# Altium project SDRplay.PrjPCB
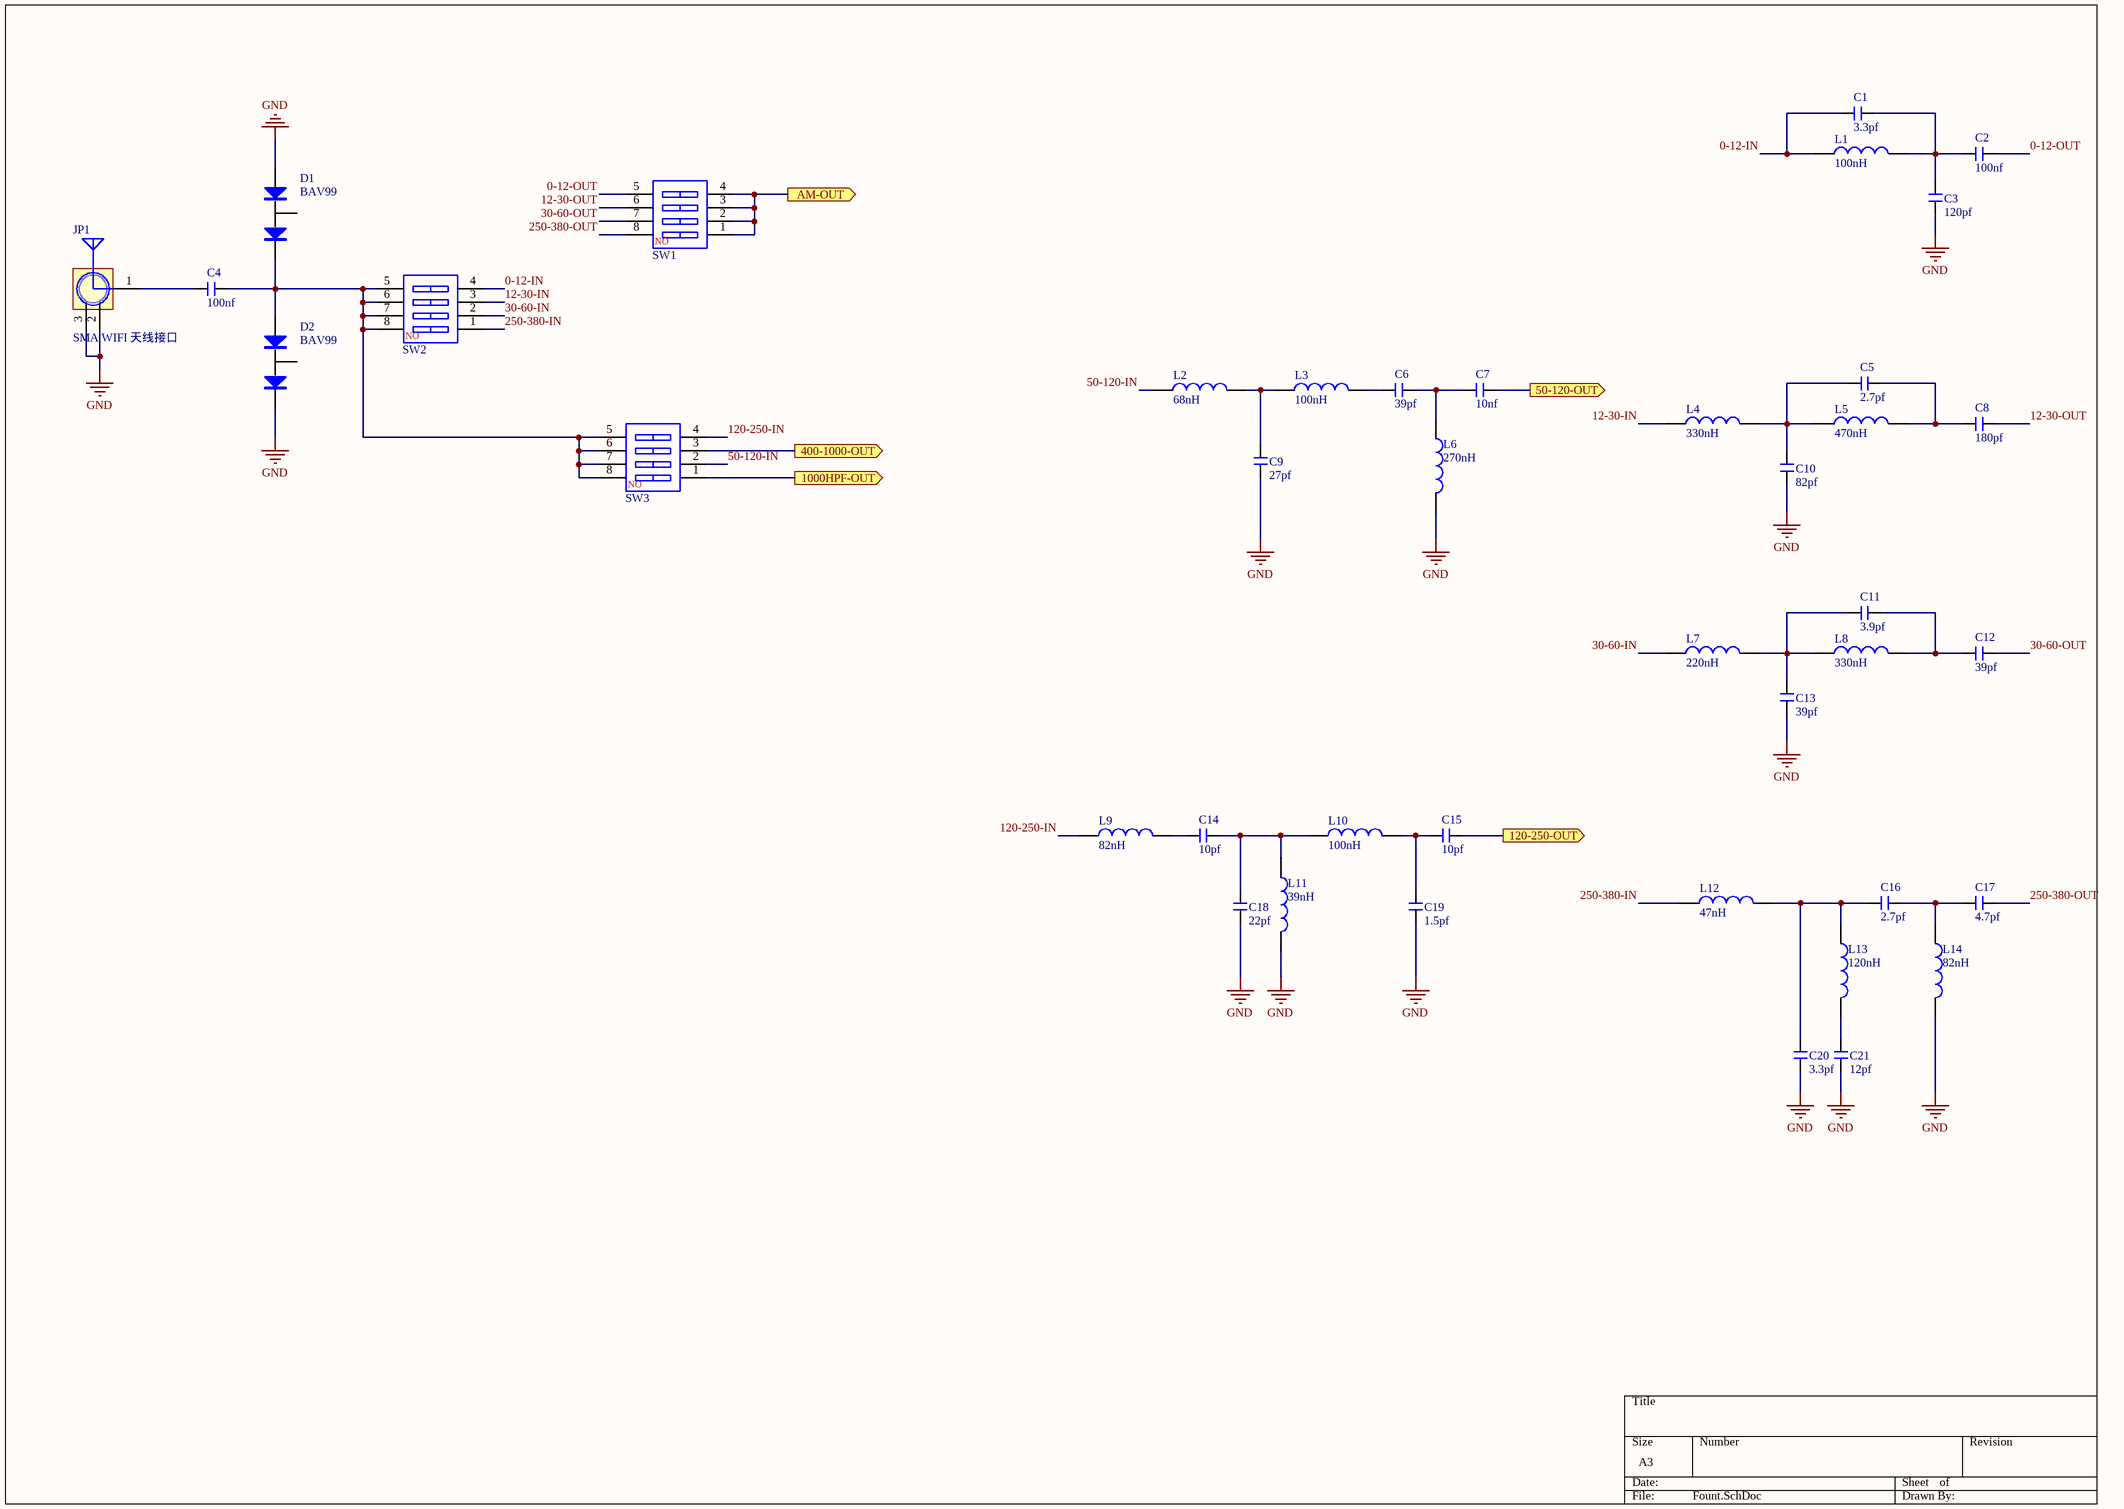
[diagram p0: Fount.SchDoc]
3 sheets, 89 parts. Net scope: flat (ports and power ports of the same name join across sheets).
Board file: SDRplay.PcbDoc
Sheets:
  Fount.SchDoc
  Msi001.SchDoc
  Msi2500.SchDoc

## Sheet Fount.SchDoc
size A3

### Parts
C1  3.3pf  [C 0603_M]
C2  100nf  [C 0603_M]
C3  120pf  [C 0603_M]
C4  100nf  [C 0603_M]
C5  2.7pf  [C 0603_M]
C6  39pf  [C 0603_M]
C7  10nf  [C 0603_M]
C8  180pf  [C 0603_M]
C9  27pf  [C 0603_M]
C10  82pf  [C 0603_M]
C11  3.9pf  [C 0603_M]
C12  39pf  [C 0603_M]
C13  39pf  [C 0603_M]
C14  10pf  [C 0603_M]
C15  10pf  [C 0603_M]
C16  2.7pf  [C 0603_M]
C17  4.7pf  [C 0603_M]
C18  22pf  [C 0603_M]
C19  1.5pf  [C 0603_M]
C20  3.3pf  [C 0603_M]
C21  12pf  [C 0603_M]
D1  BAV99  [SOT23-3M]
D2  BAV99  [SOT23-3M]
JP1  SMA WIFI 天线接口  [SMA-KE]
L1  100nH  [L 0603]
L2  68nH  [L 0603]
L3  100nH  [L 0603]
L4  330nH  [L 0603]
L5  470nH  [L 0603]
L6  270nH  [L 0603]
L7  220nH  [L 0603]
L8  330nH  [L 0603]
L9  82nH  [L 0603]
L10  100nH  [L 0603]
L11  39nH  [L 0603]
L12  47nH  [L 0603]
L13  120nH  [L 0603]
L14  82nH  [L 0603]
SW1  CSW-4P  [CSW1.27 SMD-4P]  (value not drawn)
SW2  CSW-4P  [CSW1.27 SMD-4P]  (value not drawn)
SW3  CSW-4P  [CSW1.27 SMD-4P]  (value not drawn)

### Ports
50-120-OUT (out), 120-250-OUT (out), 400-1000-OUT (out), 1000HPF-OUT (out), AM-OUT (out)

### Nets
GND: C3.1 C9.1 C10.2 C13.2 C18.1 C19.1 C20.1 C21.1 D1.1 D2.2 JP1.2(GND) JP1.3(GND) L6.2 L11.2 L14.2
0-12-IN: C1.1 L1.1 SW2.4
0-12-OUT: C2.2 SW1.5
12-30-IN: L4.1 SW2.3
12-30-OUT: C8.2 SW1.6
30-60-IN: L7.1 SW2.2
30-60-OUT: C12.2 SW1.7
50-120-IN: L2.1 SW3.2
120-250-IN: L9.1 SW3.4
250-380-IN: L12.1 SW2.1
250-380-OUT: C17.2 SW1.8
NetC1_2: C1.2 C2.1 C3.2 L1.2
NetC4_1: C4.1 JP1.1(ANT)
NetC4_2: C4.2 D1.2 D2.1 SW2.5 SW2.6 SW2.7 SW2.8 SW3.5 SW3.6 SW3.7 SW3.8
NetC5_1: C5.1 C10.1 L4.2 L5.1
NetC5_2: C5.2 C8.1 L5.2
NetC6_1: C6.1 L3.2
NetC6_2: C6.2 C7.1 L6.1
NetC7_2: C7.2 ; port 50-120-OUT
NetC9_2: C9.2 L2.2 L3.1
NetC11_1: C11.1 C13.1 L7.2 L8.1
NetC11_2: C11.2 C12.1 L8.2
NetC14_1: C14.1 L9.2
NetC14_2: C14.2 C18.2 L10.1 L11.1
NetC15_1: C15.1 C19.2 L10.2
NetC15_2: C15.2 ; port 120-250-OUT
NetC16_1: C16.1 C20.2 L12.2 L13.1
NetC16_2: C16.2 C17.1 L14.1
NetC21_2: C21.2 L13.2
NetC26_2: SW1.1 SW1.2 SW1.3 SW1.4 ; port AM-OUT
NetSW3_1: SW3.1 ; port 1000HPF-OUT
NetSW3_3: SW3.3 ; port 400-1000-OUT

Not connected (* = marked no-connect by the designer): D1 3; D2 3

### Notes on the sheet
- (in symbol CSW-4P) NO

### Library data of the parts
C1-C21 = C: 无极性贴片电容; 版权归属: 源创客; BOM名称: 无极性贴片电容; 学习资源: www.ooocke.com
D1 D2 = BAV99: 天线保护二极管
JP1 = SMA: SMA-2.4G射频天线接口; 版权归属: 源创客; BOM名称: SMA-2.4G射频天线接口; 学习资源: www.ooocke.com
L1-L14 = L: 小功率贴片电感; 版权归属: 源创客; BOM名称: 小功率贴片电感; 学习资源: www.ooocke.com
SW1-SW3 = CSW-4P: 4路编码开关; 版权归属: 源创客; BOM名称: 4路编码开关; 学习资源: www.ooocke.com

## Sheet Msi001.SchDoc
size A3
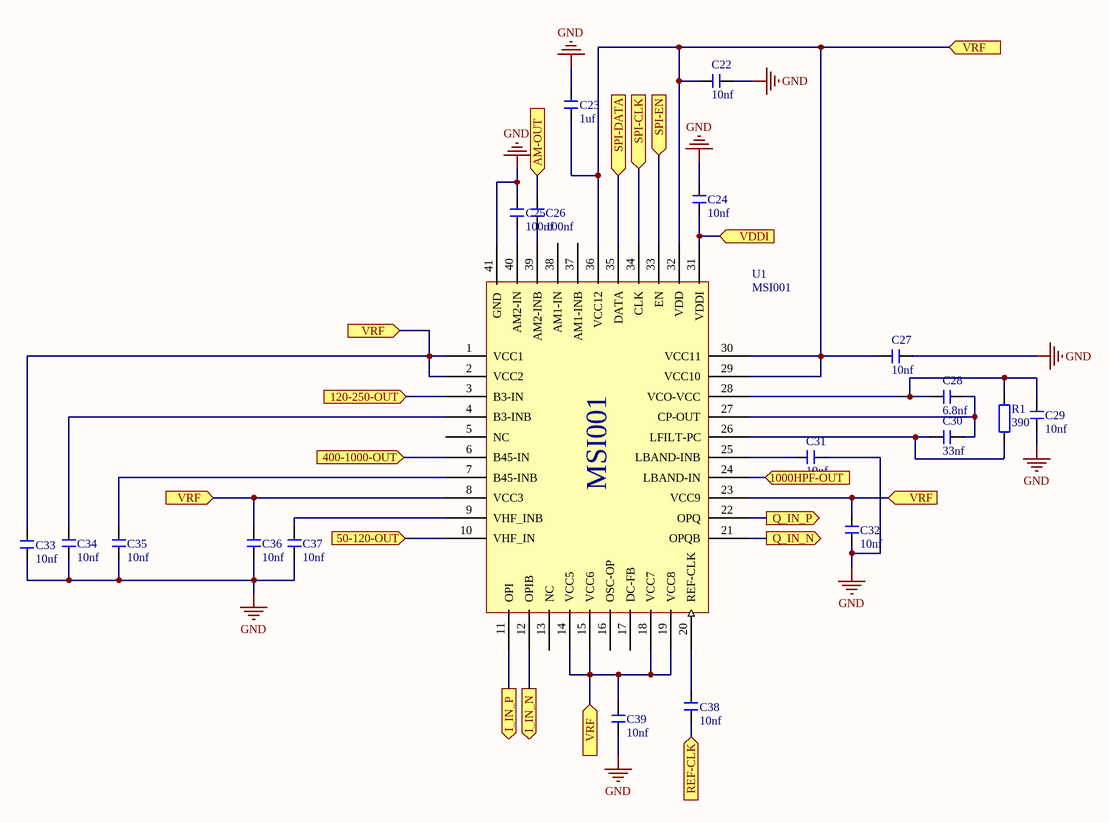
[diagram p1: Msi001.SchDoc]

### Parts
C22  10nf  [C 0603_M]
C23  1uf  [C 0603_M]
C24  10nf  [C 0603_M]
C25  100nf  [C 0603_M]
C26  100nf  [C 0603_M]
C27  10nf  [C 0603_M]
C28  6.8nf  [C 0603_M]
C29  10nf  [C 0603_M]
C30  33nf  [C 0603_M]
C31  10nf  [C 0603_M]
C32  10nf  [C 0603_M]
C33  10nf  [C 0603_M]
C34  10nf  [C 0603_M]
C35  10nf  [C 0603_M]
C36  10nf  [C 0603_M]
C37  10nf  [C 0603_M]
C38  10nf  [C 0603_M]
C39  10nf  [C 0603_M]
R1  390  [R 0603_M]
U1  MSI001  [QFN40 6X6_M]

### Ports
50-120-OUT (in), 120-250-OUT (in), 400-1000-OUT (in), 1000HPF-OUT (in), AM-OUT (in), I_IN_N (out), I_IN_P (out), Q_IN_N (out), Q_IN_P (out), REF-CLK (in), SPI-CLK (in), SPI-DATA (in), SPI-EN (in), VDDI (in), VRF (in)

### Nets
GND: C22.1 C23.2 C24.2 C25.2 C27.1 C29.2 C31.2 C32.2 C33.1 C34.1 C35.2 C36.1 C37.1 C39.2 U1.41(GND)
NetC7_2: U1.10(VHF_IN) ; port 50-120-OUT
NetC15_2: U1.3(B3-IN) ; port 120-250-OUT
NetC22_2: C22.2 C23.1 C27.2 C32.1 C33.2 C36.2 C39.1 U1.1(VCC1) U1.2(VCC2) U1.8(VCC3) U1.14(VCC5) U1.15(VCC6) U1.18(VCC7) U1.19(VCC8) U1.23(VCC9) U1.29(VCC10) U1.30(VCC11) U1.32(VDD) U1.36(VCC12) ; port VRF
NetC24_1: C24.1 U1.31(VDDI) ; port VDDI
NetC25_1: C25.1 U1.40(AM2-IN)
NetC26_1: C26.1 U1.39(AM2-INB)
NetC26_2: C26.2 ; port AM-OUT
NetC28_1: C28.1 C30.1 U1.27(CP-OUT)
NetC28_2: C28.2 C29.1 R1.1 U1.28(VCO-VCC)
NetC30_2: C30.2 R1.2 U1.26(LFILT-PC)
NetC31_1: C31.1 U1.25(LBAND-INB)
NetC34_2: C34.2 U1.4(B3-INB)
NetC35_1: C35.1 U1.7(B45-INB)
NetC37_2: C37.2 U1.9(VHF_INB)
NetC38_1: C38.1 U1.20(REF-CLK)
NetC38_2: C38.2 ; port REF-CLK
NetSW3_1: U1.24(LBAND-IN) ; port 1000HPF-OUT
NetSW3_3: U1.6(B45-IN) ; port 400-1000-OUT
NetU1_11: U1.11(OPI) ; port I_IN_P
NetU1_12: U1.12(OPIB) ; port I_IN_N
NetU1_21: U1.21(OPQB) ; port Q_IN_N
NetU1_22: U1.22(OPQ) ; port Q_IN_P
NetU1_33: U1.33(EN) ; port SPI-EN
NetU1_34: U1.34(CLK) ; port SPI-CLK
NetU1_35: U1.35(DATA) ; port SPI-DATA

Not connected (* = marked no-connect by the designer): U1 5(NC) 13(NC) 16(OSC-OP) 17(DC-FB) 37(AM1-INB) 38(AM1-IN)

### Library data of the parts
C22-C39 = C: 无极性贴片电容; 版权归属: 源创客; BOM名称: 无极性贴片电容; 学习资源: www.ooocke.com
R1 = R: 贴片电阻; 版权归属: 源创客; BOM名称: 贴片电阻; 学习资源: www.ooocke.com
U1 = MSI001: tuner

## Sheet Msi2500.SchDoc
size A3
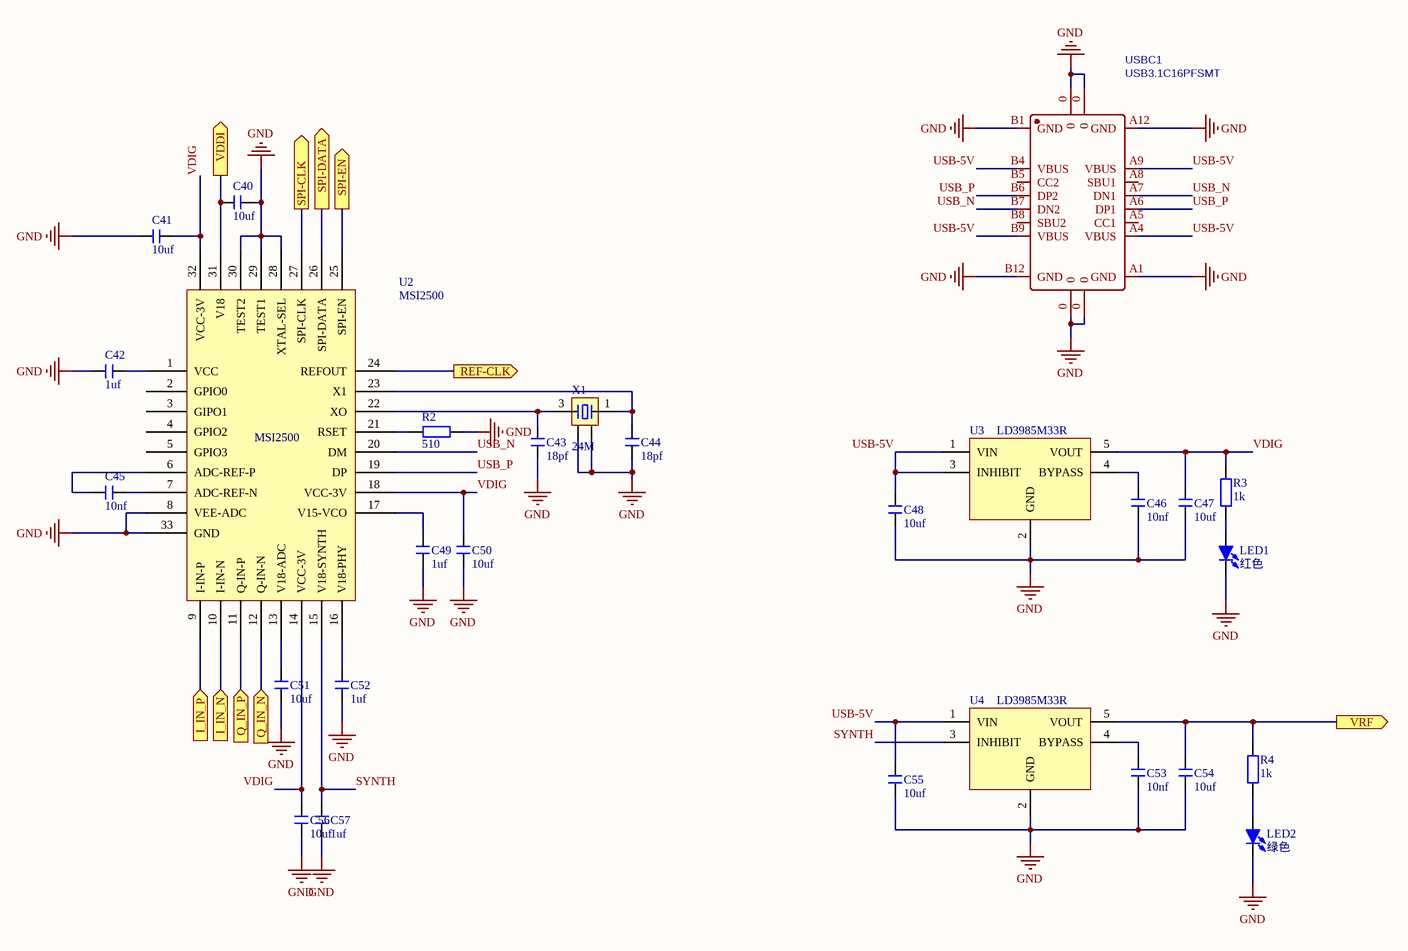
[diagram p2: Msi2500.SchDoc]

### Parts
C40  10uf  [C 0603_M]
C41  10uf  [C 0603_M]
C42  1uf  [C 0603_M]
C43  18pf  [C 0603_M]
C44  18pf  [C 0603_M]
C45  10nf  [C 0603_M]
C46  10nf  [C 0603_M]
C47  10uf  [C 0603_M]
C48  10uf  [C 0603_M]
C49  1uf  [C 0603_M]
C50  10uf  [C 0603_M]
C51  10uf  [C 0603_M]
C52  1uf  [C 0603_M]
C53  10nf  [C 0603_M]
C54  10uf  [C 0603_M]
C55  10uf  [C 0603_M]
C56  10uf  [C 0603_M]
C57  1uf  [C 0603_M]
LED1  红色  [LED 0805G]
LED2  绿色  [LED 0805G]
R2  510  [R 0603_M]
R3  1k  [R 0603_M]
R4  1k  [R 0603_M]
U2  MSI2500  [QFN32 5x5_M]
U3  LD3985M33R  [SOT23-5]
U4  LD3985M33R  [SOT23-5]
USBC1  USB3.1C16PFSMT  [USB-TYPEC-16PIN]
X1  24M  [OSC 3225-4P]

### Ports
I_IN_N (in), I_IN_P (in), Q_IN_N (in), Q_IN_P (in), REF-CLK (out), SPI-CLK (out), SPI-DATA (out), SPI-EN (out), VDDI (out), VRF (out)

### Nets
GND: C40.1 C41.2 C42.1 C43.2 C44.2 C46.1 C47.1 C48.1 C49.2 C50.2 C51.2 C52.2 C53.1 C54.1 C55.1 C56.2 C57.2 LED1.2(K) LED2.2(K) R2.1 U2.8(VEE-ADC) U2.28(XTAL-SEL) U2.29(TEST1) U2.30(TEST2) U2.33(GND) U3.2(GND) U4.2(GND) USBC1.0 USBC1.A1(GND) USBC1.A12(GND) USBC1.B1(GND) USBC1.B12(GND) X1.2 X1.4
SYNTH: C57.1 U2.15(V18-SYNTH) U4.3(INHIBIT)
USB-5V: C48.2 C55.2 U3.1(VIN) U3.3(INHIBIT) U4.1(VIN) USBC1.A4(VBUS) USBC1.A9(VBUS) USBC1.B4(VBUS) USBC1.B9(VBUS)
USB_N: U2.20(DM) USBC1.A7(DN1) USBC1.B7(DN2)
USB_P: U2.19(DP) USBC1.A6(DP1) USBC1.B6(DP2)
VDIG: C41.1 C47.2 C50.1 C56.1 R3.1 U2.14(VCC-3V) U2.18(VCC-3V) U2.32(VCC-3V) U3.5(VOUT)
NetC22_2: C54.2 R4.1 U4.5(VOUT) ; port VRF
NetC24_1: C40.2 U2.31(V18) ; port VDDI
NetC38_2: U2.24(REFOUT) ; port REF-CLK
NetC42_2: C42.2 U2.1(VCC)
NetC43_1: C43.1 U2.22(XO) X1.3
NetC44_1: C44.1 U2.23(X1) X1.1
NetC45_1: C45.1 U2.6(ADC-REF-P)
NetC45_2: C45.2 U2.7(ADC-REF-N)
NetC46_2: C46.2 U3.4(BYPASS)
NetC49_1: C49.1 U2.17(V15-VCO)
NetC51_1: C51.1 U2.13(V18-ADC)
NetC52_1: C52.1 U2.16(V18-PHY)
NetC53_2: C53.2 U4.4(BYPASS)
NetLED1_1: LED1.1(A) R3.2
NetLED2_1: LED2.1(A) R4.2
NetR2_2: R2.2 U2.21(RSET)
NetU1_11: U2.9(I-IN-P) ; port I_IN_P
NetU1_12: U2.10(I-IN-N) ; port I_IN_N
NetU1_21: U2.12(Q-IN-N) ; port Q_IN_N
NetU1_22: U2.11(Q-IN-P) ; port Q_IN_P
NetU1_33: U2.25(SPI-EN) ; port SPI-EN
NetU1_34: U2.27(SPI-CLK) ; port SPI-CLK
NetU1_35: U2.26(SPI-DATA) ; port SPI-DATA

Not connected (* = marked no-connect by the designer): U2 2(GPIO0) 3(GIPO1) 4(GPIO2) 5(GPIO3); USBC1 A5(CC1) A8(SBU1) B5(CC2) B8(SBU2)

### Library data of the parts
C40-C57 = C: 无极性贴片电容; 版权归属: 源创客; BOM名称: 无极性贴片电容; 学习资源: www.ooocke.com
LED1 LED2 = LED-SMD: 贴片LED; 版权归属: 源创客; BOM名称: 贴片LED; 学习资源: www.ooocke.com
R2-R4 = R: 贴片电阻; 版权归属: 源创客; BOM名称: 贴片电阻; 学习资源: www.ooocke.com
U3 U4 = LD3985M33R: LDO
USBC1 = USB3.1C16PFSMT: BOM_Manufacturer: LCSC; BOM_Supplier: LCSC; BOM_Supplier Part: C167321; BOM_Manufacturer Part: -; Contributor: LCSC; spicePre: U; spiceSymbolName: USB3.1C16PFSMT
X1 = XTAL-4P: 4脚无源晶振; 版权归属: 源创客; BOM名称: 4脚无源晶振; 学习资源: www.ooocke.com

## Nets that join several sheets
GND: Fount (15 pins), Msi001 (15 pins), Msi2500 (34 pins)
NetC7_2: Fount (C7.2), Msi001 (U1.10)
NetC15_2: Fount (C15.2), Msi001 (U1.3)
NetC22_2: Msi001 (19 pins), Msi2500 (C54.2 R4.1 U4.5)
NetC24_1: Msi001 (C24.1 U1.31), Msi2500 (C40.2 U2.31)
NetC26_2: Fount (SW1.1 SW1.2 SW1.3 SW1.4), Msi001 (C26.2)
NetC38_2: Msi001 (C38.2), Msi2500 (U2.24)
NetSW3_1: Fount (SW3.1), Msi001 (U1.24)
NetSW3_3: Fount (SW3.3), Msi001 (U1.6)
NetU1_11: Msi001 (U1.11), Msi2500 (U2.9)
NetU1_12: Msi001 (U1.12), Msi2500 (U2.10)
NetU1_21: Msi001 (U1.21), Msi2500 (U2.12)
NetU1_22: Msi001 (U1.22), Msi2500 (U2.11)
NetU1_33: Msi001 (U1.33), Msi2500 (U2.25)
NetU1_34: Msi001 (U1.34), Msi2500 (U2.27)
NetU1_35: Msi001 (U1.35), Msi2500 (U2.26)